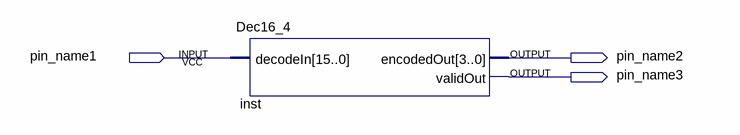
[diagram p0: schematic sheet]
// Quartus schematic Dec16_4.bdf as structural Verilog: 1 symbols, 3 pins
module Dec16_4 (
  input  pin_name1,
  output pin_name2,
  output pin_name3
);

  Dec16_4 inst (.decodeIn({16{pin_name1}}), .encodedOut(pin_name2), .validOut(pin_name3));
endmodule
